# EasyEDA Pro project ProPrj_ESP32C3_UARTLogger_2025-09-07.epro, board PCB1
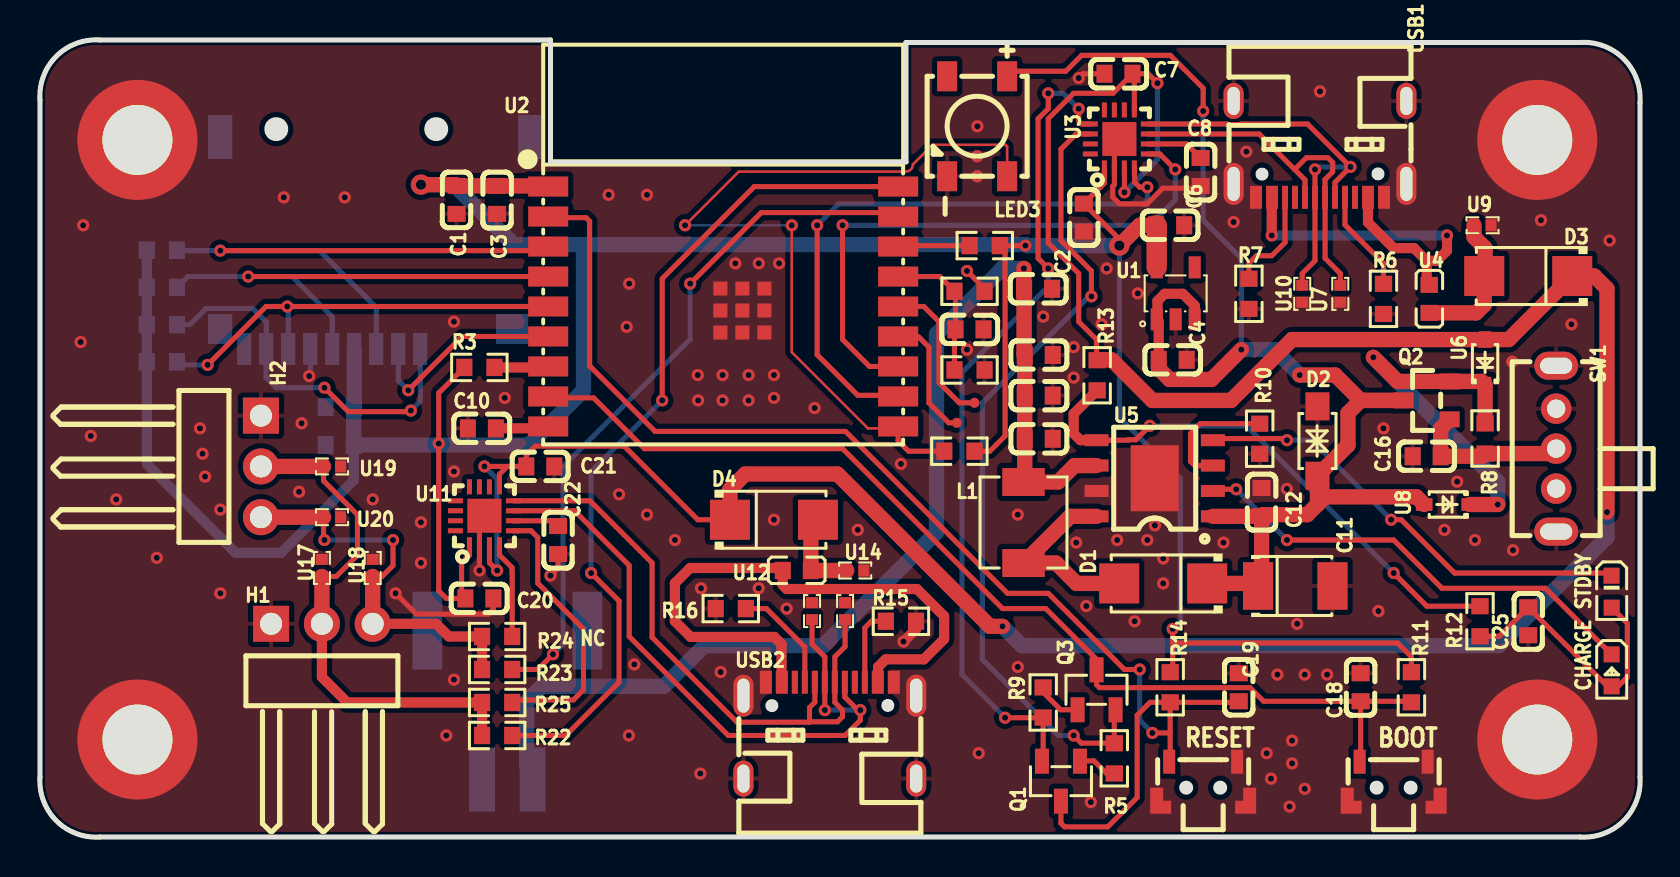
[diagram p2: board, top side]
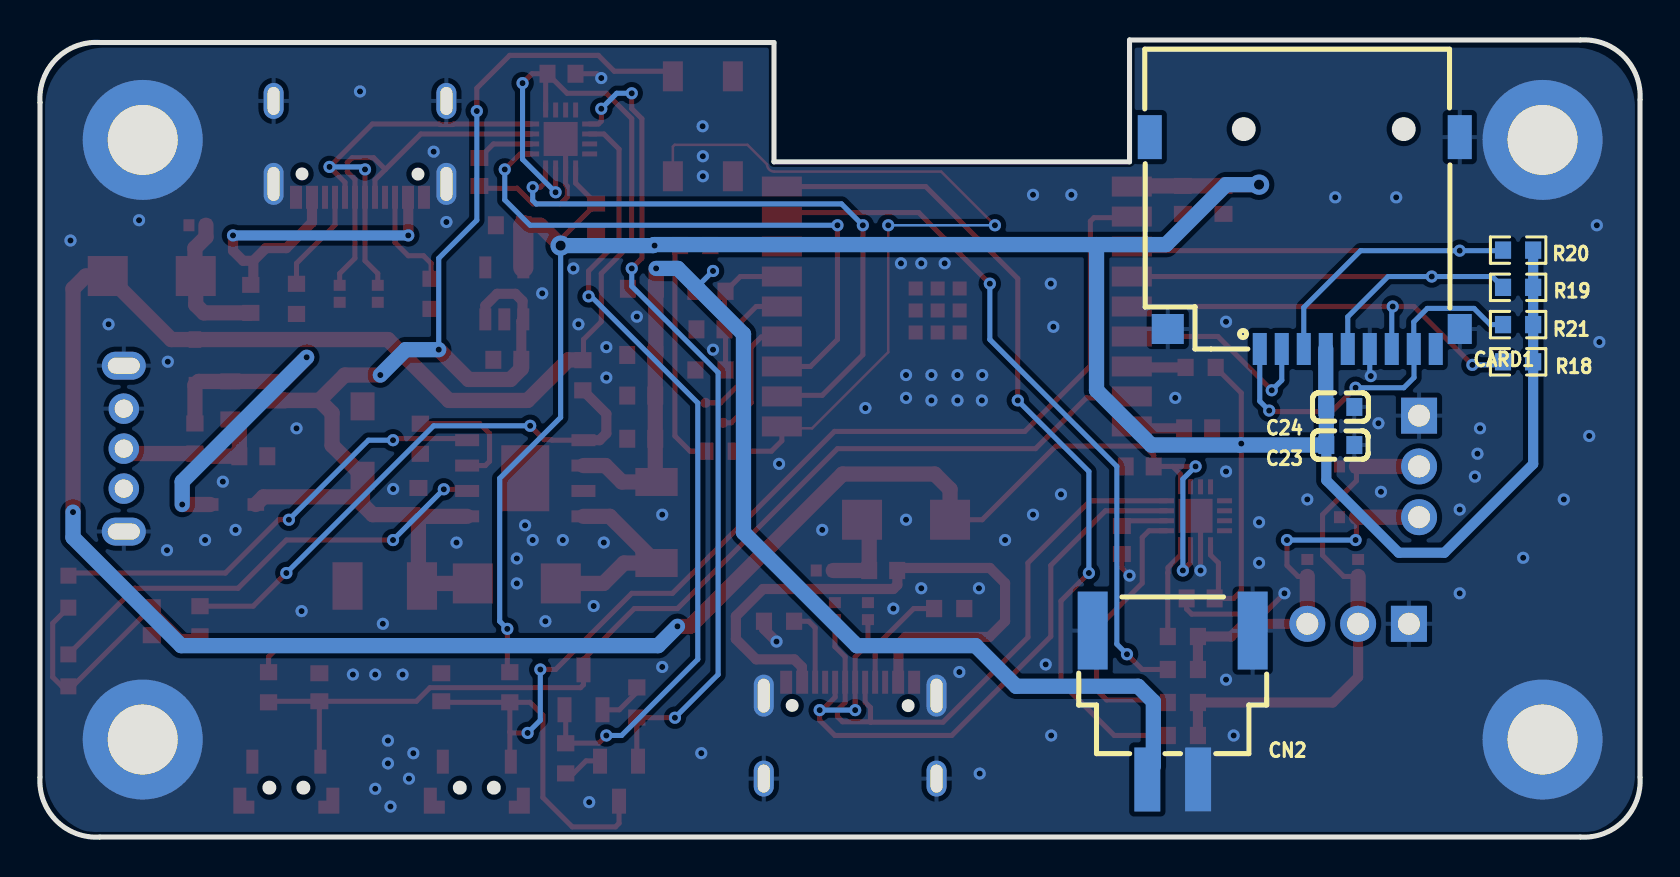
[diagram p3: board, bottom side, seen from below]

Outline 80.01 x 39.88 mm; copper layers: Top Layer, Bottom Layer. Coordinates in mm from the lower left corner of the outline.
Outline path: 0,36.88 0,3 arc(0.82,0.82) 3,0 77.01,0 arc(79.19,0.82) 80.01,3 80.01,36.75 arc(79.19,38.93) 77.01,39.75 43.31,39.75 43.31,33.78 25.53,33.78 25.53,39.88 3,39.88 arc(0.82,39.06) 0,36.88
Stack: Top Layer 0.035mm / Dielectric1 1.51mm FR4 er 4.5 / Bottom Layer 0.035mm

## Design rules (mm)
template: JLCPCB Capability(Two Layers Board)
spacing copperThickness1oz (default): track to track 0.102, other pairs 0.152 to 0.3
spacing copperThickness2oz: track to track 0.203, other pairs 0.152 to 0.3
track width copperThickness1oz (default): min 0.127, default 0.254, max 2.54
track width copperThickness2oz: min 0.203, default 0.254, max 2.54
differential pair differentialPair (default): width min 0.127, default 0.254, max 2.54; gap min 0.152, default 0.152
via viaSize (default): diameter min 0.5, default 0.61, max 10; hole min 0.3, default 0.305, max 6.3

## Placement (name value [footprint] x y rotation side)
C1  10uF  [C0603]  20.83 31.88 90 top
C2  100nF  [C0603]  49.91 27.43 180 top
C3  100nF  [C0603]  22.86 31.88 90 top
C4  10uF  [C0603]  56.64 23.88 180 top
C5  100nF  [C0603]  52.2 30.99 270 top
C6  10uF  [C0603]  56.52 30.61 180 top
C7  100nF  [C0603]  53.93 38.19 180 top
C8  100nF  [C0603]  58.04 33.27 90 top
C9  100nF  [C0603]  46.48 25.4 180 top
C10  100nF  [C0603]  22.1 20.45 0 top
C11  100uF  [CASE-B_3528]  62.77 12.56 0 top
C12  1uF  [C0603]  61.09 16.76 90 top
C13  100nF  [C0603]  49.94 19.93 180 top
C14  22uF  [C0603]  49.94 22.09 180 top
C15  22uF  [C0603]  49.94 24.12 180 top
C16  100nF  [C0603]  69.34 19.05 0 top
C18  100nF  [C0603]  66.04 7.49 90 top
C19  10uF  [C0603]  59.94 7.49 90 top
C20  100nF  [C0603]  21.97 11.94 0 top
C21  100nF  [C0603]  25.02 18.54 0 top
C22  100nF  [C0603]  25.91 14.86 90 top
C23  10uF  [C0603]  14.99 19.61 0 bottom
C24  100nF  [C0603]  14.99 21.52 0 bottom
C25  22uF  [C0603]  74.42 10.79 90 top
CARD1  TF PUSH  [TF-SMD_TF-PUSH]  16.76 29.72 0 bottom
CN2  2.54-2A-WT  [CONN-SMD_2.54-2A-WT]  23.37 6.6 0 bottom
D1  SS32  [SMA_L4.3-W2.6-LS5.2-RD]  56.17 12.69 180 top
D2  SMF6.5CA  [SOD-123FL_L2.7-W1.8-LS3.8-BI]  63.88 19.81 270 top
D3  SS22  [SMA_L4.3-W2.6-LS5.2-RD]  74.42 28.07 180 top
D4  SS22  [SMA_L4.3-W2.6-LS5.2-RD]  36.7 15.87 0 top
H1  PZ254R-11-03P  [HDR-TH_3P-P2.54-H-M-W10.4]  14.1 10.67 0 top
H2  PZ254R-11-03P  [HDR-TH_3P-P2.54-H-M-W10.4]  11.05 18.54 270 top
L1  10uH  [IND-SMD_L4.4-W4.2]  49.18 15.74 270 top
LED1  MHT192UGCT  [LED0603-RD_GREEN]  78.59 12.28 270 top
LED2  MHT192WDT-ICE  [LED0603-RD]  78.59 8.34 270 top
LED3  XL-5050RGBC-WS2812B  [LED-SMD_4P-L5.0-W5.0-BL_XL-5050RGBC]  46.86 35.56 180 top
NOREF  -  [Pad_e105]  74.87 4.88 0 top
NOREF#2  -  [Pad_e104]  4.87 4.88 0 top
NOREF#3  -  [Pad_e106]  74.87 34.88 0 top
NOREF#4  -  [Pad_e101]  4.87 34.88 0 top
Q1  MMBT3904(RANGE:100-300)  [SOT-23-3_L2.9-W1.3-P1.90-LS2.4-BR]  51.05 2.79 90 top
Q2  AO3401A  [SOT-23_L2.9-W1.3-P1.90-LS2.4-BR]  69.34 21.84 0 top
Q3  MMBT3904(RANGE:100-300)  [SOT-23-3_L2.9-W1.3-P1.90-LS2.4-BR]  52.83 7.37 270 top
R1  100kΩ  [R0603]  46.48 27.3 0 top
R2  10kΩ  [R0603]  47.24 29.59 180 top
R3  10kΩ  [R0603]  21.97 23.49 0 top
R4  100kΩ  [R0603]  46.48 23.37 180 top
R5  10kΩ  [R0603]  53.72 3.94 270 top
R6  5.1kΩ  [R0603]  67.18 26.92 270 top
R7  5.1kΩ  [R0603]  60.45 27.18 270 top
R8  100kΩ  [R0603]  72.26 19.94 90 top
R9  10kΩ  [R0603]  50.17 6.73 90 top
R10  1.1kΩ  [R0603]  60.99 19.93 90 top
R11  10kΩ  [R0603]  68.58 7.49 270 top
R12  10kΩ  [R0603]  72.01 10.79 90 top
R13  300mΩ  [R0603]  52.86 23.1 270 top
R14  10kΩ  [R0603]  56.52 7.49 270 top
R15  5.1kΩ  [R0603]  43.05 10.79 0 top
R16  5.1kΩ  [R0603]  34.54 11.43 180 top
R17  10kΩ  [R0603]  45.97 19.3 0 top
R18  10kΩ  [R0603]  6.1 23.78 180 bottom
R19  10kΩ  [R0603]  6.1 27.5 180 bottom
R20  10kΩ  [R0603]  6.1 29.36 180 bottom
R21  10kΩ  [R0603]  6.1 25.64 180 bottom
R22  0Ω  [R0603]  22.86 5.08 0 top
R23  0Ω  [R0603]  22.86 8.38 0 top
R24  0Ω  [R0603]  22.86 10.03 180 top
R25  0Ω  [R0603]  22.86 6.73 180 top
SW1  SK12D07VG4  [SW-TH_SK12D07VG4]  75.82 19.43 90 top
SW2  TS24CA  [SW-SMD_TS24CA]  67.69 2.79 180 top
SW3  TS24CA  [SW-SMD_TS24CA]  58.17 2.79 180 top
TP1  -  [Test-Point-0.5mm]  46.73 21.72 0 top
TP2  -  [Test-Point-0.5mm]  45.84 20.72 0 top
U1  ME6217C33M5G  [SOT-23-5_L3.0-W1.7-P0.95-LS2.8-BR]  56.79 27.2 270 top
U2  2.4GHz  [BULETM-SMD_ESPRESSIF_ESP32-C3-WROOM-02-N4-4MB]  34.16 26.54 0 top
U3  CH343P  [TQFN-16_L3.0-W3.0-P0.50-BL-EP1.7]  53.98 34.92 0 top
U4  UPZ1608U221-2R2TF  [L0603]  69.47 26.92 270 top
U5  TP5400  [ESOP-8_L4.9-W3.9-P1.27-LS6.0-BL-EP]  55.74 17.95 90 top
U6  1N5817WS  [SOD-323_L1.7-W1.3-LS2.6-RD-1]  72.26 23.75 90 top
U7  RCLAMP0521T-ES  [DFN1006-2L-BI]  65.02 27.18 270 top
U8  1N5817WS  [SOD-323_L1.7-W1.3-LS2.6-RD-1]  70.36 16.64 180 top
U9  RCLAMP0521T-ES  [DFN1006-2L-BI]  72.14 30.61 180 top
U10  RCLAMP0521T-ES  [DFN1006-2L-BI]  63.12 27.18 270 top
U11  CH343P  [TQFN-16_L3.0-W3.0-P0.50-BL-EP1.7]  22.23 16.07 0 top
U12  UPZ1608U221-2R2TF  [L0603]  37.85 13.33 0 top
U13  RCLAMP0521T-ES  [DFN1006-2L-BI]  38.61 11.3 90 top
U14  RCLAMP0521T-ES  [DFN1006-2L-BI]  40.77 13.33 180 top
U15  RCLAMP0521T-ES  [DFN1006-2L-BI]  40.26 11.3 90 top
U17  RCLAMP0521T-ES  [DFN1006-2L-BI]  14.1 13.46 90 top
U18  RCLAMP0521T-ES  [DFN1006-2L-BI]  16.64 13.46 90 top
U19  RCLAMP0521T-ES  [DFN1006-2L-BI]  14.61 18.54 0 top
U20  RCLAMP0521T-ES  [DFN1006-2L-BI]  14.61 16 0 top
USB1  TYPEC-304-ACP16  [USB-C-SMD_TYPE-C-16P-1]  64.01 34.42 180 top
USB2  TYPEC-304-ACP16  [USB-C-SMD_TYPE-C-16P-1]  39.5 5.33 0 top

## Footprints (pads in the part's own frame, mm; a bottom-side part is the same pattern mirrored in y, then rotated)
BULETM-SMD_ESPRESSIF_ESP32-C3-WROOM-02-N4-4MB
  rect 2x1 smd: 1(-8.75,6) 2(-8.75,4.5) 3(-8.75,3) 4(-8.75,1.5) 5(-8.75,0) 6(-8.75,-1.5) 7(-8.75,-3) 8(-8.75,-4.5) 9(-8.75,-6) 10(8.75,-6) 11(8.75,-4.5) 12(8.75,-3) 13(8.75,-1.5) 14(8.75,0) 15(8.75,1.5) 16(8.75,3) 17(8.75,4.5) 18(8.75,6)
  rect 0.7x0.7 smd: 19(-0.14,0.9) 19(-0.14,-0.2) 19(-0.14,-1.3) 19(0.96,0.9) 19(0.96,-0.2) 19(0.96,-1.3) 19(2.06,0.9) 19(2.06,-0.2) 19(2.06,-1.3)
C0603
  rect 0.8x0.9 smd: 1(-0.7,0) 2(0.7,0)
CASE-B_3528
  rect 1.506x2.376 smd: 1(-1.861,0) 2(1.861,0)
CONN-SMD_2.54-2A-WT
  rect 1.3x3.2 smd: 1(-1.27,3.725) 2(1.27,3.725)
  rect 1.5x3.9 smd: 3(-4,-3.725) 4(4,-3.725)
DFN1006-2L-BI
  rect 0.55x0.6 smd: 1(-0.425,0) 2(0.425,0)
ESOP-8_L4.9-W3.9-P1.27-LS6.0-BL-EP
  rect 0.6x1.2 smd: 1(-1.905,-2.909) 2(-0.635,-2.909) 3(0.635,-2.909) 4(1.905,-2.909) 5(1.905,2.909) 6(0.635,2.909) 7(-0.635,2.909) 8(-1.905,2.909)
  rect 3.3x2.4 smd: 9(0,0)
HDR-TH_3P-P2.54-H-M-W10.4
  rect 1.8x1.8 hole 1.1: 1(-2.54,0)
  round 1.8 hole 1.1: 2(0,0) 3(2.54,0)
IND-SMD_L4.4-W4.2
  rect 1.4x2.12 smd: 1(2.028,0) 2(-2.028,0)
L0603
  rect 0.8x0.864 smd: 1(-0.7,0) 2(0.7,0)
LED0603-RD
  rect 0.8x0.8 smd: 1(-0.799,0) 2(0.799,0)
LED0603-RD_GREEN
  rect 0.8x0.8 smd: 1(-0.799,-0.004) 2(0.799,0.004)
LED-SMD_4P-L5.0-W5.0-BL_XL-5050RGBC
  rect 1x1.5 smd: 1(-1.5,-2.5) 2(1.5,-2.5) 3(1.5,2.5) 4(-1.5,2.5)
Pad_e101
  round 6 hole 3.5: 1(0,0)
Pad_e104
  round 6 hole 3.5: 1(0,0)
Pad_e105
  round 6 hole 3.5: 1(0,0)
Pad_e106
  round 6 hole 3.5: 1(0,0)
R0603
  rect 0.806x0.864 smd: 1(-0.753,0) 2(0.753,0)
SMA_L4.3-W2.6-LS5.2-RD
  rect 2x2 smd: 1(-2.2,0) 2(2.2,0)
SOD-123FL_L2.7-W1.8-LS3.8-BI
  rect 1.4x1.2 smd: 1(-1.735,0) 2(1.735,0)
SOD-323_L1.7-W1.3-LS2.6-RD-1
  rect 0.83x0.63 smd: 1(-1.14,0) 2(1.14,0)
SOT-23-3_L2.9-W1.3-P1.90-LS2.4-BR
  rect 1.25x0.7 smd: 1(1,-0.95) 2(1,0.95) 3(-1,0)
SOT-23-5_L3.0-W1.7-P0.95-LS2.8-BR
  rect 1.1x0.6 smd: 1(1.3,-0.95) 2(1.3,0) 3(1.3,0.95) 4(-1.3,0.95) 5(-1.3,-0.95)
SOT-23_L2.9-W1.3-P1.90-LS2.4-BR
  rect 1x0.8 smd: 1(1.15,-0.95) 2(1.15,0.95) 3(-1.15,0)
SW-SMD_TS24CA
  custom 1.05x1.3 smd: 1(-2.125,0.975) 2(2.125,0.975)
  rect 0.6x1.2 smd: 3(-1.7,-0.975) 4(1.7,-0.975)
SW-TH_SK12D07VG4
  round 1.524 hole 0.914: 1(-2,0) 2(0,0) 3(2,0)
  oval 1.4x2.2 hole 0.8x1.6: 4(4.15,0) 5(-4.15,0)
Test-Point-0.5mm
  round 0.5 smd: 1(0,0)
TF-SMD_TF-PUSH
  rect 0.7x1.6 smd: 1(2.25,5.3) 2(1.15,5.3) 3(0.05,5.3) 4(-1.05,5.3) 5(-2.15,5.3) 6(-3.25,5.3) 7(-4.35,5.3) 8(-5.45,5.3) CD(-6.55,5.3)
  rect 1.2x1.5 smd: 10(-7.75,4.3)
  rect 1.2x2.2 smd: 11(-7.75,-5.3) 12(7.75,-5.3)
  rect 1.6x1.5 smd: 13(6.85,4.3)
TQFN-16_L3.0-W3.0-P0.50-BL-EP1.7
  rect 0.25x0.75 smd: 1(-0.749,-1.45) 2(-0.248,-1.45) 3(0.252,-1.45) 4(0.751,-1.45) 9(0.75,1.45) 10(0.25,1.45) 11(-0.25,1.45) 12(-0.749,1.45)
  rect 0.75x0.25 smd: 5(1.45,-0.75) 6(1.45,-0.25) 7(1.45,0.25) 8(1.45,0.75) 13(-1.45,0.75) 14(-1.45,0.25) 15(-1.45,-0.25) 16(-1.45,-0.75)
  rect 1.7x1.7 smd: 17(0.001,0)
USB-C-SMD_TYPE-C-16P-1
  rect 0.6x1.15 smd: A1B12(-3.2,2.41) A4B9(-2.4,2.41) B1A12(3.2,2.41) B4A9(2.4,2.41)
  rect 0.3x1.15 smd: A5(-1.25,2.41) A6(-0.25,2.41) A7(0.25,2.41) A8(1.25,2.41) B5(1.75,2.41) B6(0.75,2.41) B7(-0.75,2.41) B8(-1.75,2.41)
  oval 1x2.1 hole 0.6x1.7: EP(-4.32,1.74) EP(4.32,1.74)
  oval 1x1.8 hole 0.6x1.4: EP(-4.32,-2.41) EP(4.32,-2.41)

## Nets
As in the schematic, except:
GND: C1.1 C2.1 C3.1 C4.1 C5.2 C6.1 C7.2 C8.1 C9.1 C10.1 C11.2 C12.2 C13.1 C14.1 C15.1 C16.1 C18.2 C19.2 C20.2 C21.2 C22.1 C23.1 C24.1 C25.1 CARD1.6 CARD1.10 CARD1.11 CARD1.13 CN2.1 CN2.3 CN2.4 D2.1 H1.1 H2.1 LED3.3 NOREF.1 NOREF#2.1 NOREF#3.1 NOREF#4.1 R4.1 R6.2 R7.2 R10.1 R15.2 R16.2 SW1.3 SW1.4 SW1.5 SW2.1 SW2.2 SW2.3 SW3.1 SW3.2 SW3.3 U1.2 U2.19 U3.2 U3.17 U5.7 U5.9 U7.2 U9.1 U10.2 U11.2 U11.17 U13.2 U14.1 U15.2 U17.2 U18.2 U19.2 U20.2 USB1.A1B12 USB1.B1A12 USB1.EP USB2.A1B12 USB2.B1A12 USB2.EP

Pads without a net: CARD1 12 CD; LED3 2; SW1 1; U1 4; U3 10 11 12 15 16; U11 10 11 12 13 14 15 16; USB1 A8 B8; USB2 A8 B8

## Via types
v1: diameter 0.61, hole 0.305, Top Layer to Bottom Layer, 159 vias
v2: diameter 1.016, hole 0.508, Top Layer to Bottom Layer, 2 vias

## Routing (per net, layer and track width the routed paths; a pad name or vN(x,y) marks a point on that pad's centre or on a via; arc(x,y) is an arc through that point)
GND: length 22
  Top Layer w0.254: v1(17.78,12.19) 18.82,11.15 22.42,11.15 22.67,11.4 C20.2 ; C7.2 52.16,38.19 v1(51.94,37.97) ; U3.17 53.73,34.68 U3.2 53.73,32.64 53.64,32.56 53.64,32.02 53.99,31.67 55.36,31.67 56.14,32.46 57.92,32.46 C8.1 ; v1(25.53,13.08) 25.91,13.46 C22.1 ; v1(21.98,13.33) U11.2 21.98,15.82 U11.17
  Top Layer w0.508: v1(43.18,9.78) 43.81,10.41 R15.2
  Bottom Layer w0.254: CARD1.6 13.51,23.11 v1(13.46,23.06)
  vias: v1(2.03,24.76) v1(2.16,30.61) v1(2.54,20.07) v1(3.81,16.89) v1(5.84,13.97) v1(8,20.45) v1(8.13,19.18) v1(8.26,18.03) v1(9.02,16.38) v1(9.02,12.19) v1(12.19,32) v1(12.95,17.27) v1(13.08,20.7) v1(15.24,32) v1(16.64,16.89) v1(19.05,15.75) v1(19.05,13.72) v1(20.32,5.08) v1(20.7,25.78) v1(20.7,18.29) v1(20.7,7.87) v1(23.24,21.97) v1(28.44,32.13) v1(28.96,17.14) v1(29.34,25.53) v1(29.46,27.69) v1(29.45,5.08) v1(29.72,8.64) v1(30.35,32.13) v1(30.35,16.13) v1(31.75,14.86) v1(32.89,23.11) v1(32.91,21.84) v1(33.02,3.17) v1(33.06,12.45) v1(34.04,8.25) v1(34.13,23.11) v1(34.13,21.84) v1(34.77,28.7) v1(35.43,23.11) v1(35.43,21.84) v1(35.94,28.7) v1(35.94,12.45) v1(36.7,23.11) v1(36.7,21.97) v1(36.7,15.87) v1(36.96,28.7) v1(37.34,11.43) v1(38.73,21.46) v1(40.89,15.37) v1(43.05,18.67) v1(46.36,24.38) v1(46.88,35.56) v1(46.86,34.06) v1(46.86,33.06) v1(46.94,4.19) v1(48.89,16.13) v1(48.89,8.51) v1(50.17,26.03) v1(51.69,24.51) v1(51.69,22.99) v1(51.82,14.73) v1(52.32,11.56) v1(52.55,1.74) v1(53.09,25.65) v1(53.34,28.45) v1(53.86,14.86) v1(54.74,10.79) v1(54.9,27.2) v1(55.37,14.86) v1(55.75,15.59) v1(56.17,13.94) v1(56.17,12.69) v1(59.18,14.73) v1(59.69,30.77) v1(60.33,34.29) v1(61.34,4.19) v1(61.56,2.92) v1(61.88,8.13) v1(62.35,17.41) v1(62.48,1.52) v1(62.61,4.83) v1(62.61,3.68) v1(62.86,10.67) v1(63.25,8.13) v1(63.25,2.41) v1(64.01,37.3) v1(64.36,8.13) v1(66.93,11.3) v1(67.18,20.45) v1(70.23,15.37) v1(70.87,17.78) v1(71.76,14.86) v1(73.62,23.78) v1(73.66,14.35) v1(75.06,30.86) v1(76.58,25.65) v1(78.49,29.84)
VBUS: length 144.7
  Top Layer w0.254: v1(54.23,32.26) 54.23,33.47 U3.3 ; v1(55.88,37.72) 55.41,38.19 C7.1 ; U11.9 22.98,18.15 23.37,18.54 ; v1(22.23,18.54) 23.37,18.54 ; 23.37,18.54 C21.1 24.32,19.11 24.77,19.56 29.21,19.56 32.89,15.87 D4.1 ; 52.86,23.85 52.83,23.89 52.83,24.89 51.94,25.78 51.94,28.19 50.42,29.72 50.42,35.94 51.69,37.21 53.65,37.21 C7.1 ; U3.9 54.73,38.09 C7.1 ; U11.3 22.48,13.72 v1(22.86,13.33)
  Top Layer w0.762: v1(48.13,10.54) 47.5,10.54 39.88,18.16 35.27,18.16 34.5,17.4 D4.1 ; 52.86,23.85 52.88,23.87 53.6,23.87 55.63,21.84 59.56,21.84 62.61,24.89 U6.2 73.44,24.89 D3.1 77.72,28.07 78.36,27.43 v1(78.36,16.26)
  Bottom Layer w0.254: v1(22.86,13.33) 22.86,17.91 v1(22.23,18.54) ; v1(54.23,32.26) 55.88,33.91 v1(55.88,37.72)
  Bottom Layer w0.762: v1(48.13,10.54) 49.1,9.58 72.95,9.58 78.36,14.99 v1(78.36,16.26)
VCC: length 168
  Top Layer w0.254: R17.2 47.5,19.3 48.26,20.07 48.26,29.33 R2.1 v1(49.28,29.59) ; R11.1 68.58,9.02 67.89,9.7 56.82,9.7 56.64,9.52 ; 56.64,9.52 v1(56.64,10.41) ; 56.64,9.52 56.64,8.37 R14.1 ; U3.1 53.23,32.72 C5.1 53.98,29.91 v2(53.98,29.59) ; U11.1 21.48,14.11 21.08,13.72 21.08,12.13 C20.1 20.32,11.94 19.94,12.32 v1(19.94,19.68) 19.94,22.22 R3.1
  Top Layer w0.762: v2(19.05,32.64) 20.77,32.64 C1.2 C3.2 25.51,32.58 25.54,32.54 ; C6.2 54.99,30.61 v2(53.98,29.59)
  Top Layer w1.016: U1.5 55.84,30.58 C6.2
  Bottom Layer w0.254: v1(19.94,19.68) 19.94,19.68 20.01,19.61 ; v2(53.98,29.59) 53.98,20.99 57.02,17.95 57.02,10.79 v1(56.64,10.41) ; v1(49.28,29.59) 49.3,29.62 49.3,29.64
  Bottom Layer w0.508: R20.2 R19.2 R21.2 R18.2 5.34,18.66 9.78,14.22 12.06,14.22 15.69,17.84 C23.2
  Bottom Layer w0.762: 27.18,29.64 23.7,29.64 20.7,32.64 v2(19.05,32.64) ; 27.18,29.64 49.3,29.64 49.36,29.59 v2(53.98,29.59) ; 27.18,29.64 27.18,22.35 24.44,19.61 C23.2 C24.2 15.71,21.54 15.71,24.42
VCC5V: length 70.9
  Top Layer w0.254: v1(58.17,36.32) 58.17,37.46 56.52,39.11 52.09,39.11 51.29,38.31 48.62,38.31 LED3.1
  Top Layer w0.508: 55.94,23.88 55.94,25.8 U1.1 55.88,25.94 55.88,26.82 56.24,27.18 57.15,27.18 57.74,26.59 U1.3
  Top Layer w0.762: v1(60.07,24.38) 58.58,22.89 56.48,22.89 55.94,23.43 55.94,23.88 ; 69.22,16.64 68.84,17.02 64.26,17.02 63.88,16.64 ; D1.1 60.78,12.69 C11.1 61.09,12.74 C12.1 ; 66.04,21.84 64.77,23.11 v1(62.99,23.11) ; 66.04,21.84 Q2.3 66.04,21.84 ; 66.04,21.84 65.41,21.21 65.41,19.6 D2.2 63.88,16.64 ; C12.1 61.15,16.13 63.37,16.13 63.88,16.64 ; C12.1 61.07,16.04 U5.1
  Bottom Layer w0.254: v1(60.07,24.38) 60.07,28.96 58.17,30.86 v1(58.17,36.32)
  Bottom Layer w0.762: v1(60.07,24.38) 61.72,24.38 v1(62.99,23.11)
BAT+: length 61
  Top Layer w0.254: v1(46.36,28.32) 47.24,27.44 R1.2
  Top Layer w0.762: v1(49.2,28.45) 49.2,27.44 C2.2 49.21,24.15 C15.2 C14.2 C13.2 49.24,17.83 L1.2 50.91,17.76 51.73,18.58 U5.6
  Bottom Layer w0.254: v1(46.36,28.32) 47.09,27.58 47.09,27.42
  Bottom Layer w0.762: 24.64,2.88 24.64,3.26 24.33,3.56 24.33,6.78 25.1,7.54 31.19,7.54 33.23,9.57 39.17,9.57 44.83,15.24 44.83,25.16 48.11,28.45 v1(49.2,28.45)
D+: length 18.5
  Top Layer w0.254: U3.7 60.96,35.17 62.74,33.4 ; 62.74,33.4 63.32,33.98 64.4,33.98 64.64,33.75 64.64,33.28 64.26,32.9 USB1.A6 ; 62.74,33.4 63.26,32.88 USB1.B6 ; U7.1 65.02,28.19 64.26,28.96 64.26,32
D+_UART_OUT: length 33.3
  Top Layer w0.254: U11.7 26.73,16.32 29.46,13.59 29.46,10.03 34.42,5.08 40.26,5.08 41.02,5.84 41.02,6.22 40.89,6.35 ; USB2.B6 40.25,7 40.89,6.35 ; U13.1 38.61,9.65 39.25,9.01 USB2.A6 v1(39.25,6.35) ; 40.89,6.35 v1(41.02,6.35)
  Bottom Layer w0.254: v1(39.25,6.35) v1(41.02,6.35)
D-: length 20.7
  Top Layer w0.254: USB1.B7 64.76,32.75 v1(65.53,33.53) 63.39,35.67 60.04,35.67 60.01,35.65 59.37,35.65 59.34,35.67 U3.8 ; v1(63.76,33.4) USB1.A7 63.76,28.83 63.12,28.19 U10.1
  Bottom Layer w0.254: v1(65.53,33.53) 63.89,33.53 v1(63.76,33.4)
D-_UART_OUT: length 30.6
  Top Layer w0.254: 40.13,10.88 40.2,10.81 ; U11.8 27.5,16.82 30.61,13.72 30.61,9.99 34.85,5.74 38.48,5.74 ; 38.48,5.74 38.48,6.48 38.75,6.74 USB2.B7 ; 38.48,5.74 38.5,5.77 39.88,5.77 40.13,6.02 40.13,6.35 39.75,6.73 USB2.A7 39.75,9.01 40.26,9.52 40.26,10.75
DEVICE_RX: length 20
  Top Layer w0.254: U20.1 14.18,14.9 v1(14.22,14.86) ; U18.1 17.1,13.04 17.65,13.59 v1(17.65,14.86)
  Top Layer w0.508: H1.3 19.81,10.67 20.45,10.03 R24.2 R23.1
  Top Layer w0.762: H2.3 U20.1 ; U18.1 H1.3
  Bottom Layer w0.254: v1(14.22,14.86) v1(17.65,14.86)
DEVICE_TX: length 25.7
  Top Layer w0.254: U19.1 14.18,17.82 15.88,16.13 15.88,14.1 14.81,13.04 U17.1
  Top Layer w0.508: H1.2 14.1,8 15.37,6.73 R25.2 R22.1
  Top Layer w0.762: U19.1 H2.2 ; U17.1 H1.2
DTR: length 40.3
  Top Layer w0.254: Q3.2 53.72,6.3 R5.1 53.71,4.7 52.07,4.7 v1(51.69,5.08) ; U3.14 51.81,35.17 51.05,34.42 51.05,29.84 52.58,28.32 v1(52.58,27.05)
  Bottom Layer w0.254: v1(52.58,27.05) 52.45,27.05 47.12,21.72 47.12,8.89 50.93,5.08 v1(51.69,5.08)
IO0_RX: length 42.4
  Top Layer w0.254: v1(31.11,21.84) 31.11,27.94 35.72,32.54 U2.18 ; R22.2 26.29,5.08 28.96,7.75 28.96,11.81 v1(27.56,13.21)
  Bottom Layer w0.254: v1(31.11,21.84) 27.56,18.29 v1(27.56,13.21)
IO1_TX: length 35.7
  Top Layer w0.254: R23.2 24.89,8.38 v1(25.65,9.14) ; U2.17 42.71,31.24 36.07,31.24 v1(32.51,27.69)
  Bottom Layer w0.254: v1(32.51,27.69) 32.51,24.89 26.16,18.54 26.16,9.65 v1(25.65,9.14)
IO2: length 3.5
  Top Layer w0.254: 43.04,29.54 43.09,29.59 R2.2
IO3_BAT_MON: length 7
  Top Layer w0.254: R4.2 45.73,25.35 45.78,25.4 45.78,27.25 R1.1 44.99,28.04 43.04,28.04
IO4_MOSI: length 29.7
  Top Layer w0.254: U2.3 25.21,29.34 v1(9.02,29.34)
  Bottom Layer w0.254: CARD1.3 16.81,26.49 13.97,29.34 v1(9.02,29.34) 6.88,29.34 R20.1
IO5_CLK: length 25.4
  Top Layer w0.254: U2.4 v1(10.41,28.04)
  Bottom Layer w0.254: R19.1 7.39,28.04 v1(10.41,28.04) 12.6,28.04 14.61,26.03 CARD1.5
IO6_MISO: length 22
  Top Layer w0.254: U2.5 v1(12.37,26.54) 11.3,26.54 v1(8.38,23.62)
  Bottom Layer w0.254: v1(12.37,26.54) 12.41,26.49 12.41,24.42 ; v1(8.38,23.62) 7,23.62 R18.1
IO7_CS: length 10.4
  Top Layer w0.254: v1(18.42,22.35) 21.11,25.04 U2.6
  Bottom Layer w0.254: CARD1.2 17.91,22.85 v1(18.42,22.35)
IO9_BOOT: length 53.2
  Top Layer w0.254: 66.04,6.79 66.04,3.82 65.99,3.77 ; 66.04,6.79 61.19,6.79 60.51,7.47 52.98,7.47 52.83,7.62 Q3.3 52.83,8.89 50.29,11.43 48.13,11.43 40.13,19.43 30.23,19.43 27.69,21.97 25.61,21.97 25.54,22.04 ; 66.04,6.79 68.53,6.79 R11.2
IO10_RMT_DOUT: length 41.2
  Top Layer w0.127: U2.10 42.82,20.45 41.4,20.45 37.59,24.26 v1(37.59,30.61) ; v1(32.26,30.61) 34.94,33.29 43.29,33.29 arc(43.55,33.4) 43.65,33.65 44.63,34.63 48.27,34.63 48.36,34.54 LED3.4
  Top Layer w0.254: U2.10 42.91,19.82 43.43,19.3 R17.1
  Bottom Layer w0.127: v1(32.26,30.61) v1(37.59,30.61)
IO18: length 6.4
  Top Layer w0.254: U2.13 42.94,25.02 43.94,25.02 44.45,24.51 44.45,21.72 45.44,20.72 TP2.1
IO19: length 7.6
  Top Layer w0.254: TP1.1 45.97,21.72 44.96,22.74 44.96,25.78 44.2,26.54 U2.14
RESET: length 65.6
  Top Layer w0.254: Q1.3 51.05,0.69 51.23,0.51 53.39,0.51 54.86,1.98 54.86,6.1 55.51,6.74 R14.2 ; 56.52,5.26 56.46,5.21 v1(55.63,5.21) ; 56.52,5.26 R14.2 ; 56.52,5.26 56.52,3.82 56.47,3.77 ; v1(54.99,8.38) 54.23,8.38 50.42,12.19 48.38,12.19 40.28,20.29 30.76,20.29 27.48,23.57 27.48,30.81 27.3,30.99 25.47,30.99 U2.2 ; R14.2 59.89,6.74
  Bottom Layer w0.254: v1(54.99,8.38) 54.99,5.84 v1(55.63,5.21)
RTS: length 41.6
  Top Layer w0.254: v1(50.42,28.45) 49.91,28.96 49.91,35.94 50.42,36.44 v1(50.42,37.21) ; U3.13 52.08,35.67 51.94,35.81 v1(51.94,36.44) ; v1(48.26,5.97) 50.16,5.97 R9.1 50.17,3.85 Q1.2
  Bottom Layer w0.254: v1(50.42,37.21) 51.17,37.21 v1(51.94,36.44) ; v1(50.42,28.45) 50.42,27.56 46.1,23.24 46.1,8.13 v1(48.26,5.97)
U0RXD: length 30.7
  Top Layer w0.254: v1(55.37,32.51) 54.99,32.51 54.74,32.77 54.74,33.46 U3.4 ; v1(38.86,30.61) 38.86,24.13 40.89,22.1 42.98,22.1 43.04,22.04
  Bottom Layer w0.254: v1(55.37,32.51) 55.37,31.85 55.19,31.67 39.93,31.67 v1(38.86,30.61)
U0TXD: length 29.5
  Top Layer w0.254: v1(40.13,30.61) 40.13,24.89 41.48,23.54 43.04,23.54 ; v1(56.77,33.4) 56,34.17 U3.5
  Bottom Layer w0.254: v1(56.77,33.4) 56.77,31.88 55.5,30.61 v1(40.13,30.61)
$1N331: length 2.8
  Top Layer w0.508: 25.54,20.54 25.44,20.45 C10.2
$1N913: length 2
  Top Layer w0.254: R5.2 53.33,3.18 52.7,3.81 52.02,3.81 Q1.1
$1N914: length 2.3
  Top Layer w0.254: Q3.1 51.04,6.37 50.17,7.24 R9.2
$1N1037: length 2.8
  Top Layer w0.508: 25.54,23.54 25.49,23.49 R3.2
$1N2511: length 2.9
  Top Layer w0.254: U3.6 57.34,34.67 C8.2
$1N2849: length 5.3
  Top Layer w0.254: USB1.B5 62.26,29.75 61.6,29.08 60.83,29.08 60.45,28.7 R7.1
$1N2855: length 18.9
  Top Layer w0.508: 69.34,28.83 69.85,28.83 70.36,29.34 v1(70.36,30.1) ; 69.34,28.83 69.34,27.75 U4.1 ; 69.34,28.83 68.71,29.46 67.69,29.46 66.41,30.75 USB1.A4B9 ; v1(61.6,30.1) 61.6,31.99 61.61,32.01
  Bottom Layer w0.508: v1(61.6,30.1) v1(70.36,30.1)
$1N2861: length 5.1
  Top Layer w0.254: R6.1 67.18,28.7 65.26,30.63 USB1.A5
$1N3712: length 2.3
  Top Layer w0.254: 25.97,15.75 25.84,15.75 25.77,15.82 U11.6
$1N4143: length 30.6
  Top Layer w0.508: 37.15,13.33 37.14,13.34 ; 37.14,13.34 37.02,13.46 32.51,13.46 31.75,12.7 31.75,10.79 32.53,10.01 36.73,10.01 37.08,9.65 37.08,7.76 USB2.A4B9 ; 37.14,13.34 37.14,12.61 37.34,12.41 43.85,12.41 45.21,11.05 45.21,9.91 44.2,8.89 42.29,8.89 41.91,8.51 41.91,7.76 USB2.B4A9
$1N4164: length 5.5
  Top Layer w0.254: USB2.A5 38.25,9.5 36.32,11.43 R16.1
$1N5573: length 3.9
  Top Layer w0.254: USB2.B5 41.25,10.47 41.57,10.79 R15.1
$1N5644: length 4.5
  Top Layer w0.762: D4.2 38.55,15.52 U12.2 U14.2
$1N5686: length 7.1
  Top Layer w0.762: U9.2 71.71,30.02 72.26,29.46 72.26,28.11 72.22,28.07 72.22,26.63 71.82,26.22 U4.2
$1N9313: length 9.8
  Top Layer w0.762: 53.97,12.69 51.83,12.69 50.81,13.71 L1.1 51.52,16.04 U5.8
$1N9314: length 6.3
  Top Layer w0.254: R10.2 58.02,20.68 57.53,20.19 57.53,18.8 57.74,18.58 U5.3
$1N9315: length 22.8
  Top Layer w0.254: v1(67.56,15.87) 68.07,15.87 70.74,13.21 78.45,13.21 LED1.1 ; v1(62.36,19.85) 62.28,19.94 58.73,19.94 U5.4
  Bottom Layer w0.254: v1(62.36,19.85) 63.58,19.85 v1(67.56,15.87)
$1N9316: length 23.4
  Top Layer w0.254: v1(59.82,17.4) 58.74,17.4 U5.2 ; v1(62.36,14.86) 67.69,14.86 70.1,12.45 75.28,12.45 78.59,9.14
  Bottom Layer w0.254: v1(59.82,17.4) v1(62.36,14.86)
$1N9317: length 27.1
  Top Layer w0.254: v1(55.5,20.57) 54.8,19.88 54.43,19.88 54.4,19.85 U5.5 ; v1(67.69,13.21) 69.35,11.55 R12.2
  Top Layer w0.508: R13.2 51.69,21.17 51.69,20.19 52.03,19.85 U5.5
  Bottom Layer w0.254: v1(67.69,13.21) 60.33,20.57 v1(55.5,20.57)
$1N9320: length 13.6
  Top Layer w0.254: R12.1 72.97,10.04 C25.2 78.38,7.54 78.91,7.54 79.38,8 79.38,10.69 LED1.2
$1N9326: length 19.4
  Top Layer w0.762: v1(66.67,24) 67.88,22.79 Q2.2 72.08,22.79 U6.1 R8.2 ; U8.1 v1(72.9,16.64)
  Bottom Layer w0.762: v1(66.67,24) 72.9,17.78 v1(72.9,16.64)
$1N9327: length 8
  Top Layer w0.762: SW1.2 75.57,19.19 R8.1 72.13,19.05 C16.2 70.04,20.44 Q2.1
$1N15856: length 19.1
  Top Layer w0.254: v1(18.54,21.34) 18.54,21.28 15.42,21.28 v1(14.22,22.48)
  Bottom Layer w0.254: 19.01,24.42 19.01,21.81 v1(18.54,21.34) ; R21.1 7.49,25.64 8.3,26.45 10.64,26.45 11.31,25.77 CARD1.8 11.3,24.41 11.3,22.99 11.81,22.48 v1(14.22,22.48)
$1N37074: length 4.9
  Top Layer w0.254: U11.4 22.98,14.11 23.6,13.48 23.6,13.23 23.61,13.22 R24.1
$1N37118: length 13.8
  Top Layer w0.254: R25.1 23.74,6.86 26.67,6.86 27.18,7.37 27.18,10.41 24.89,12.7 24.89,14.99 24.56,15.32 U11.5

## Copper pours and planes (outline as drawn; the poured copper is in the pictures)
GND on Top Layer: 0.13,36.88 0.14,37.14 0.19,37.48 0.28,37.82 0.41,38.15 0.57,38.45 0.77,38.74 1.01,39 1.27,39.23 1.55,39.43 1.86,39.6 2.18,39.73 2.52,39.82 2.87,39.87 3.13,39.88 76.88,39.88 77.14,39.87 77.49,39.82 77.83,39.73 78.15,39.6 78.46,39.43 78.74,39.23 79,39 79.24,38.74 79.44,38.45 79.6,38.15 79.73,37.82 79.82,37.48 79.87,37.14 79.88,36.88 79.88,2.87 79.87,2.61 79.82,2.27 79.73,1.93 79.6,1.61 79.44,1.3 79.24,1.01 79,0.75 78.74,0.52 78.46,0.32 78.15,0.15 77.83,0.03 77.49,-0.07 77.14,-0.12 76.88,-0.13 3.13,-0.13 2.87,-0.12 2.52,-0.07 2.18,0.03 1.86,0.15 1.55,0.32 1.27,0.52 1.01,0.75 0.77,1.01 0.57,1.3 0.41,1.61 0.28,1.93 0.19,2.27 0.14,2.61 0.13,2.87
GND on Bottom Layer: 0.25,36.5 0.27,36.76 0.32,37.1 0.41,37.44 0.54,37.76 0.7,38.07 0.9,38.36 1.13,38.62 1.39,38.85 1.68,39.05 1.99,39.22 2.31,39.34 2.65,39.44 2.99,39.49 3.25,39.5 76.76,39.5 77.02,39.49 77.36,39.44 77.7,39.34 78.02,39.22 78.33,39.05 78.62,38.85 78.88,38.62 79.11,38.36 79.31,38.07 79.47,37.76 79.6,37.44 79.69,37.1 79.74,36.76 79.76,36.5 79.76,3.13 79.74,2.87 79.69,2.52 79.6,2.18 79.47,1.86 79.31,1.55 79.11,1.27 78.88,1.01 78.62,0.77 78.33,0.57 78.02,0.41 77.7,0.28 77.36,0.19 77.02,0.14 76.76,0.13 3.25,0.13 2.99,0.14 2.65,0.19 2.31,0.28 1.99,0.41 1.68,0.57 1.39,0.77 1.13,1.01 0.9,1.27 0.7,1.55 0.54,1.86 0.41,2.18 0.32,2.52 0.27,2.87 0.25,3.13

## Text on the board
Top Silkscreen Layer: NC | STDBY | CHARGE | RESET | BOOT
